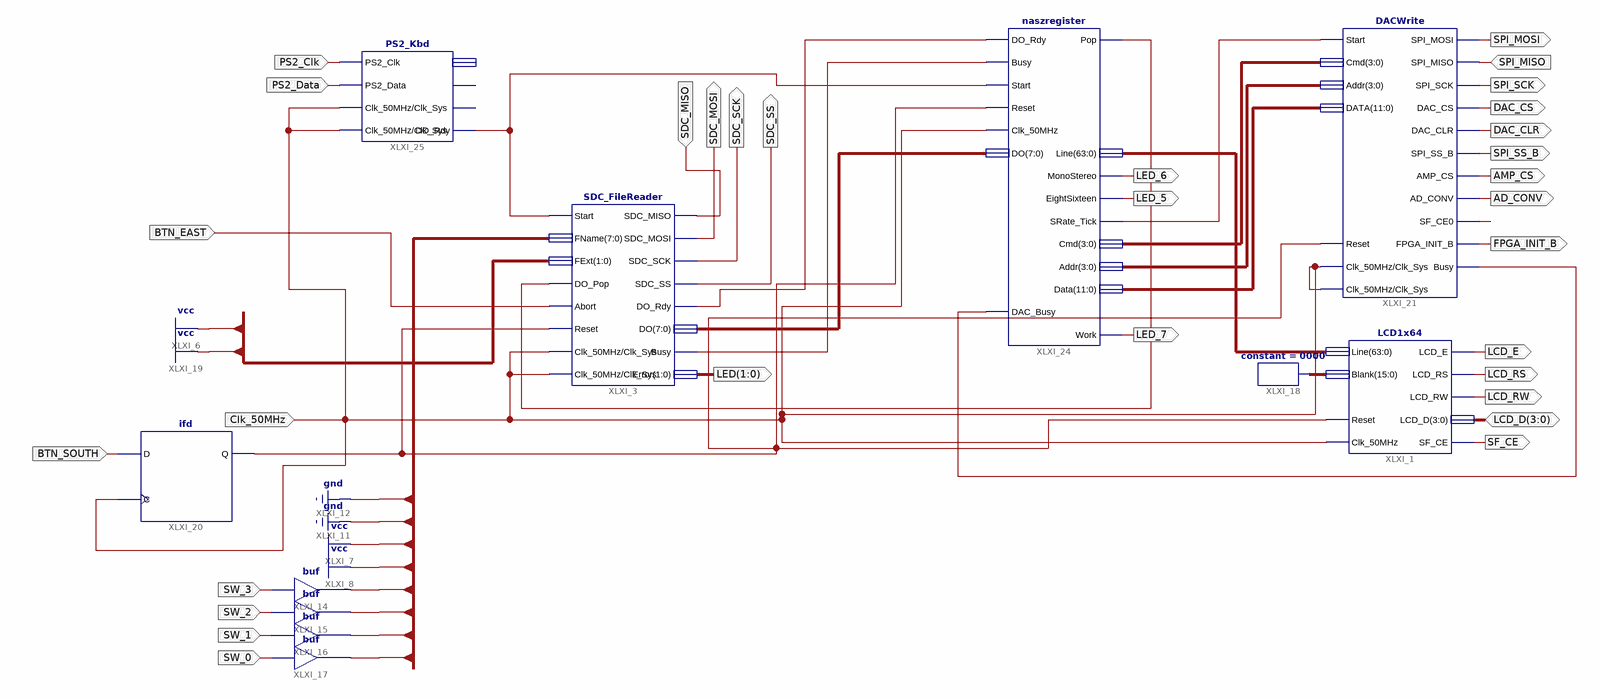
[diagram p0: schematic sheet 1]
// Xilinx ISE schematic WAV_reader_total.sch (spartan3e) as structural Verilog: 11 symbols, 31 ports
module WAV_reader_total (
  input  Clk_50MHz,
  input  SDC_MISO,
  input  SW_3,
  input  SW_2,
  input  SW_1,
  input  SW_0,
  input  BTN_EAST,
  input  BTN_SOUTH,
  input  SPI_MISO,
  input  PS2_Clk,
  input  PS2_Data,
  inout  [3:0] LCD_D,
  output [1:0] LED,
  output SDC_MOSI,
  output SDC_SS,
  output SDC_SCK,
  output LCD_E,
  output LCD_RS,
  output LCD_RW,
  output SF_CE,
  output LED_6,
  output LED_5,
  output SPI_MOSI,
  output SPI_SCK,
  output DAC_CS,
  output DAC_CLR,
  output SPI_SS_B,
  output AMP_CS,
  output AD_CONV,
  output FPGA_INIT_B,
  output LED_7
);

  wire XLXN_59, XLXN_84, XLXN_87, XLXN_93, XLXN_95, XLXN_104, XLXN_106, XLXN_109;
  wire [3:0] FName, XLXN_88, XLXN_89;
  wire [7:0] XLXN_85;
  wire [11:0] XLXN_90;
  wire [15:0] XLXN_55;
  wire [63:0] XLXN_1;

  SDC_FileReader XLXI_3 (
    .SDC_MISO(SDC_MISO), .Start(XLXN_109), .FName({4'b0011, FName}), .Reset(XLXN_59), .Clk_50MHz(Clk_50MHz),
    .DO_Pop(XLXN_87), .Abort(BTN_EAST), .SDC_MOSI(SDC_MOSI), .SDC_SCK(SDC_SCK), .SDC_SS(SDC_SS), .Error(LED),
    .DO(XLXN_85), .DO_Rdy(XLXN_84), .Busy(XLXN_106), .FExt(2'b11), .Clk_Sys(Clk_50MHz));
  buf XLXI_14 (FName[3], SW_3);
  buf XLXI_15 (FName[2], SW_2);
  buf XLXI_16 (FName[1], SW_1);
  buf XLXI_17 (FName[0], SW_0);
  ifd XLXI_20 (.C(Clk_50MHz), .D(BTN_SOUTH), .Q(XLXN_59));
  DACWrite XLXI_21 (
    .Reset(XLXN_59), .Start(XLXN_93), .SPI_MISO(SPI_MISO), .Cmd(XLXN_88), .Addr(XLXN_89), .DATA(XLXN_90),
    .DAC_CLR(DAC_CLR), .DAC_CS(DAC_CS), .SPI_MOSI(SPI_MOSI), .SPI_SCK(SPI_SCK), .SPI_SS_B(SPI_SS_B),
    .AMP_CS(AMP_CS), .AD_CONV(AD_CONV), .SF_CE0(XLXN_104), .FPGA_INIT_B(FPGA_INIT_B), .Busy(XLXN_95),
    .Clk_50MHz(Clk_50MHz), .Clk_Sys(Clk_50MHz));
  naszregister XLXI_24 (
    .DO_Rdy(XLXN_84), .Busy(XLXN_106), .DAC_Busy(XLXN_95), .Start(XLXN_109), .Reset(XLXN_59),
    .Clk_50MHz(Clk_50MHz), .DO(XLXN_85), .Pop(XLXN_87), .MonoStereo(LED_6), .EightSixteen(LED_5),
    .SRate_Tick(XLXN_93), .Cmd(XLXN_88), .Addr(XLXN_89), .Data(XLXN_90), .Line(XLXN_1), .Work(LED_7));
  LCD1x64 XLXI_1 (
    .Clk_50MHz(Clk_50MHz), .Reset(XLXN_59), .Line(XLXN_1), .Blank(XLXN_55), .LCD_D(LCD_D), .LCD_E(LCD_E),
    .LCD_RW(LCD_RW), .LCD_RS(LCD_RS), .SF_CE(SF_CE));
  constant #(.CValue("0000")) XLXI_18 (.O(XLXN_55));
  PS2_Kbd XLXI_25 (
    .PS2_Clk(PS2_Clk), .PS2_Data(PS2_Data), .Clk_50MHz(Clk_50MHz), .DO_Rdy(XLXN_109), .Clk_Sys(Clk_50MHz));  // open: E0, F0, DO
endmodule
